# EAGLE design PCB-Neopixel Control (EAGLE 9.5.2)
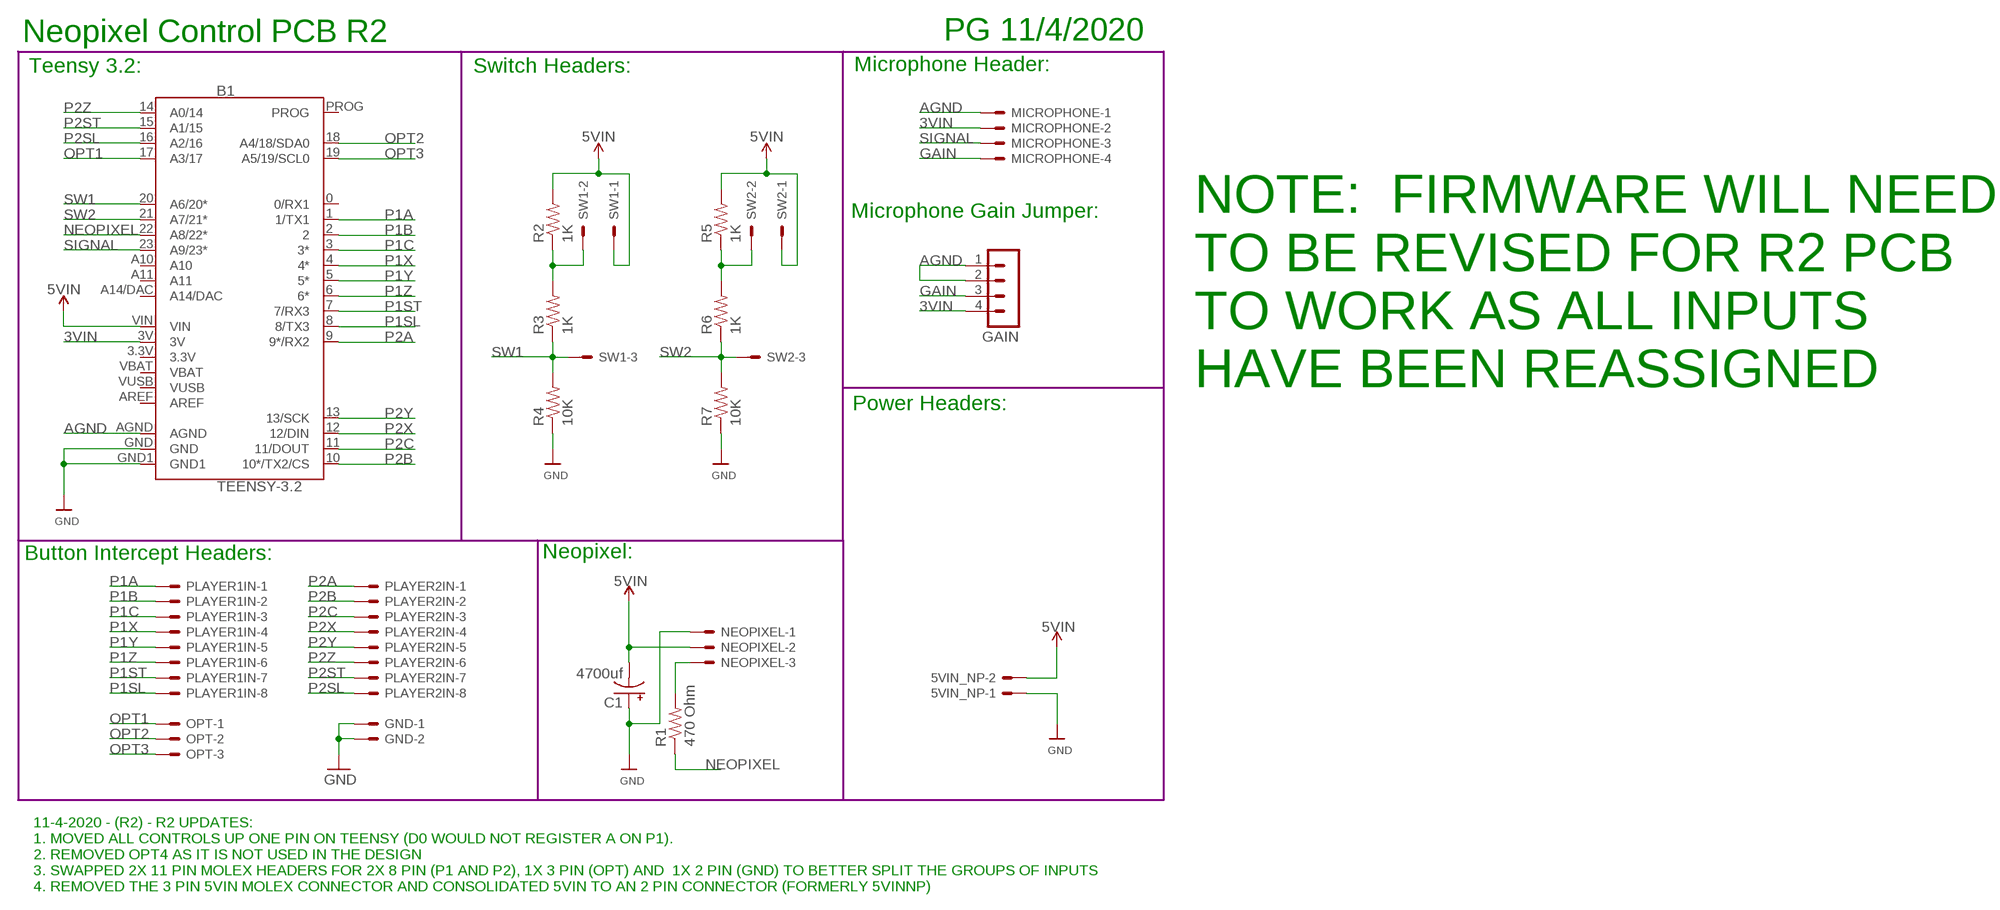
[diagram p0: schematic, sheet 1]

## Parts
5VIN_NP  KK-156-2  [KK-156-2]
B1  TEENSY-3.2  TEENSY-3.1SILK  [TEENSY-3.1]
C1  4700uf  CPOL-USE5-13  [E5-13]
GAIN  MA04-1  [MA04-1]
GND  KK-156-2  [KK-156-2]
MICROPHONE  KK-156-4  [KK-156-4]
NEOPIXEL  KK-156-3  [KK-156-3]
OPT  KK-156-3  [KK-156-3]
PLAYER1IN  KK-156-8  [KK-156-8]
PLAYER2IN  KK-156-8  [KK-156-8]
R1  470 Ohm  R-US_R1206  [R1206]
R2  1K  R-US_R1206  [R1206]
R3  1K  R-US_R1206  [R1206]
R4  10K  R-US_R1206  [R1206]
R5  1K  R-US_R1206  [R1206]
R6  1K  R-US_R1206  [R1206]
R7  10K  R-US_R1206  [R1206]
SW1  KK-156-3  [KK-156-3]
SW2  KK-156-3  [KK-156-3]

## Nets
3VIN: B1.3V GAIN.4 MICROPHONE.2
5VIN: 5VIN_NP.2 B1.VIN C1.- NEOPIXEL.2 R2.2 R5.2 SW1.1 SW2.1 ; supply symbol labelled 5VINNP
AGND: B1.AGND GAIN.1 GAIN.2 MICROPHONE.1
GAIN: GAIN.3 MICROPHONE.4
GND: 5VIN_NP.1 B1.GND B1.GND1 C1.+ GND.1 GND.2 NEOPIXEL.1 R4.1 R7.1
NEOPIXEL: B1.22(A8/22*) R1.1
NP2T: NEOPIXEL.3 R1.2
OPT1: B1.17(A3/17) OPT.1
OPT2: B1.18(A4/18/SDA0) OPT.2
OPT3: B1.19(A5/19/SCL0) OPT.3
P1A: B1.1(1/TX1) PLAYER1IN.1
P1B: B1.2 PLAYER1IN.2
P1C: B1.3(3*) PLAYER1IN.3
P1SL: B1.8(8/TX3) PLAYER1IN.8
P1ST: B1.7(7/RX3) PLAYER1IN.7
P1X: B1.4(4*) PLAYER1IN.4
P1Y: B1.5(5*) PLAYER1IN.5
P1Z: B1.6(6*) PLAYER1IN.6
P2A: B1.9(9*/RX2) PLAYER2IN.1
P2B: B1.10(10*/TX2/CS) PLAYER2IN.2
P2C: B1.11(11/DOUT) PLAYER2IN.3
P2SL: B1.16(A2/16) PLAYER2IN.8
P2ST: B1.15(A1/15) PLAYER2IN.7
P2X: B1.12(12/DIN) PLAYER2IN.4
P2Y: B1.13(13/SCK) PLAYER2IN.5
P2Z: B1.14(A0/14) PLAYER2IN.6
SIGNAL: B1.23(A9/23*) MICROPHONE.3
SW1: B1.20(A6/20*) R3.1 R4.2 SW1.3
SW1A: R2.1 R3.2 SW1.2
SW2: B1.21(A7/21*) R6.1 R7.2 SW2.3
SW2A: R5.1 R6.2 SW2.2
Unconnected: B1.0(0/RX1) B1.A10 B1.A11 B1.A14/DAC B1.AREF B1.PROG

## Notes on the sheet
- Neopixel Control PCB R2 | PG 11/4/2020
- Teensy 3.2: | Switch Headers: | Microphone Header:
- Microphone Gain Jumper:
- NOTE:  FIRMWARE WILL NEED 
  TO BE REVISED FOR R2 PCB 
  TO WORK AS ALL INPUTS 
  HAVE BEEN REASSIGNED
- Power Headers:
- Button Intercept Headers: | Neopixel:
- 11-4-2020 - (R2) - R2 UPDATES:
  1. MOVED ALL CONTROLS UP ONE PIN ON TEENSY (D0 WOULD NOT REGISTER A ON P1).
  2. REMOVED OPT4 AS IT IS NOT USED IN THE DESIGN
  3. SWAPPED 2X 11 PIN MOLEX HEADERS FOR 2X 8 PIN (P1 AND P2), 1X 3 PIN (OPT) AND  1X 2 PIN (GND) TO BETTER SPLIT THE GROUPS OF INPUTS
  4. REMOVED THE 3 PIN 5VIN MOLEX CONNECTOR AND CONSOLIDATED 5VIN TO AN 2 PIN CONNECTOR (FORMERLY 5VINNP)

## Power pins joined to a net without a drawn wire
3.3V: B1.3.3V
VBAT: B1.VBAT
VUSB: B1.VUSB

## Library data of the parts
5VIN_NP GND = con-molex:KK-156-2: KK 156 HEADER Source: http://www.molex.com/pdm_docs/sd/026604100_sd.pdf; MF: MOLEX; OC_FARNELL: unknown; OC_NEWARK: unknown
B1 = SparkFun-Boards:TEENSY-3.1: Teensy 3+ Footprint Mechanical footprint with connectors for Teensy Development Board with ARM Cortex. SparkFun Products: Teensy 3.2 <https://www.sparkfun.com/products/13736> Teensy LC <https://www.sparkfun.com/products/13305>; SF_ID: DEV-12646
C1 = adafruit:CPOL-US: POLARIZED CAPACITOR, American symbol
GAIN = con-lstb:MA04-1: PIN HEADER; OC_FARNELL: unknown; OC_NEWARK: unknown
MICROPHONE = con-molex:KK-156-4: KK 156 HEADER Source: http://www.molex.com/pdm_docs/sd/026604100_sd.pdf; MF: MOLEX; OC_FARNELL: unknown; OC_NEWARK: unknown
NEOPIXEL OPT SW1 SW2 = con-molex:KK-156-3: KK 156 HEADER Source: http://www.molex.com/pdm_docs/sd/026604100_sd.pdf; MF: MOLEX; OC_FARNELL: unknown; OC_NEWARK: unknown
PLAYER1IN PLAYER2IN = con-molex:KK-156-8: KK 156 HEADER Source: http://www.molex.com/pdm_docs/sd/026604100_sd.pdf; MF: MOLEX; OC_FARNELL: unknown; OC_NEWARK: unknown
R1-R7 = adafruit:R-US_: RESISTOR, American symbol

## Board
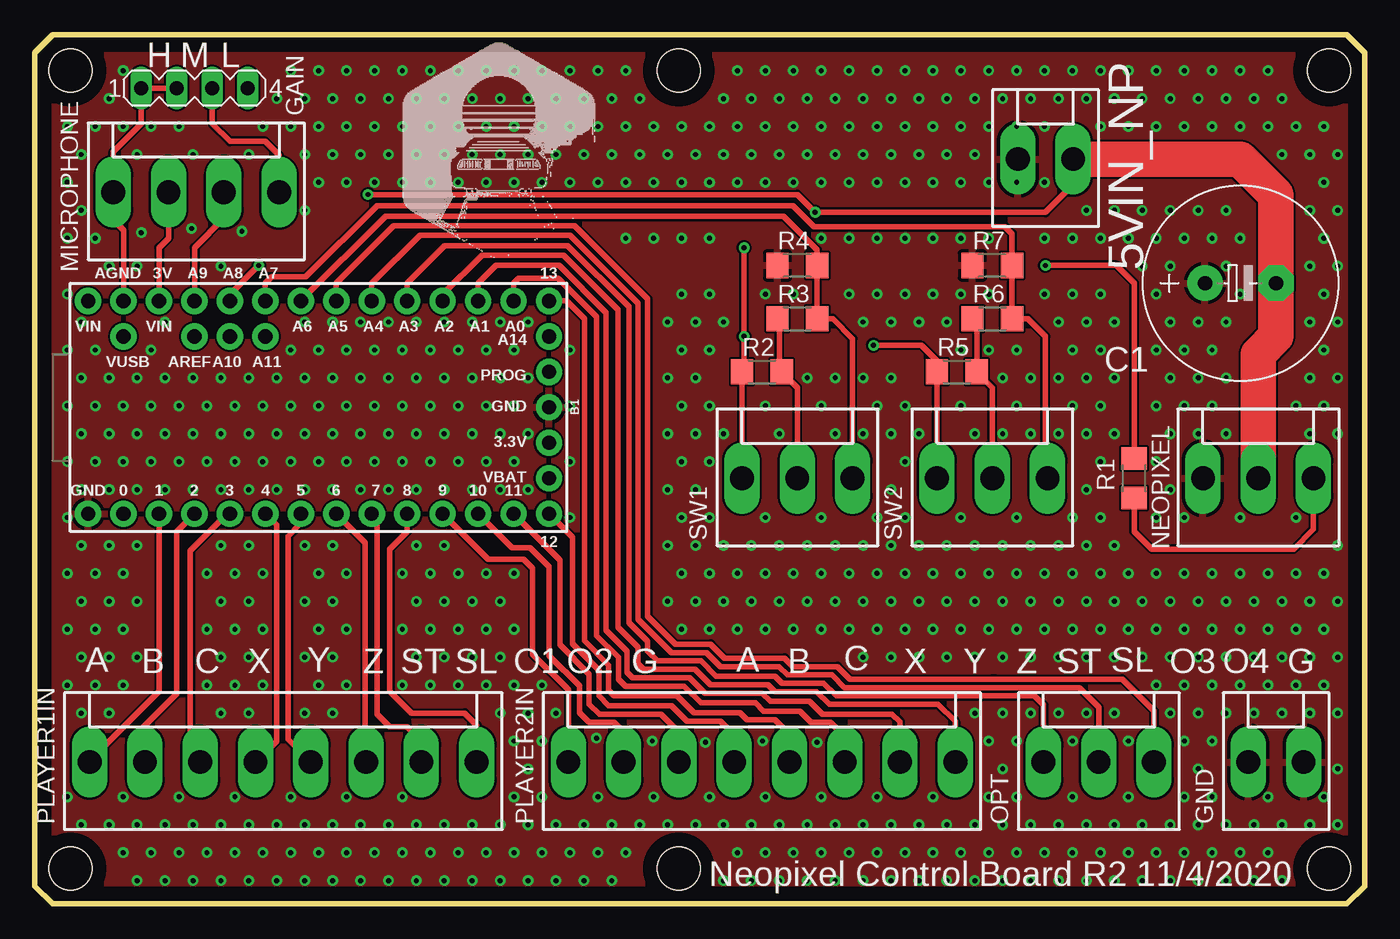
[diagram p1: board, top side]
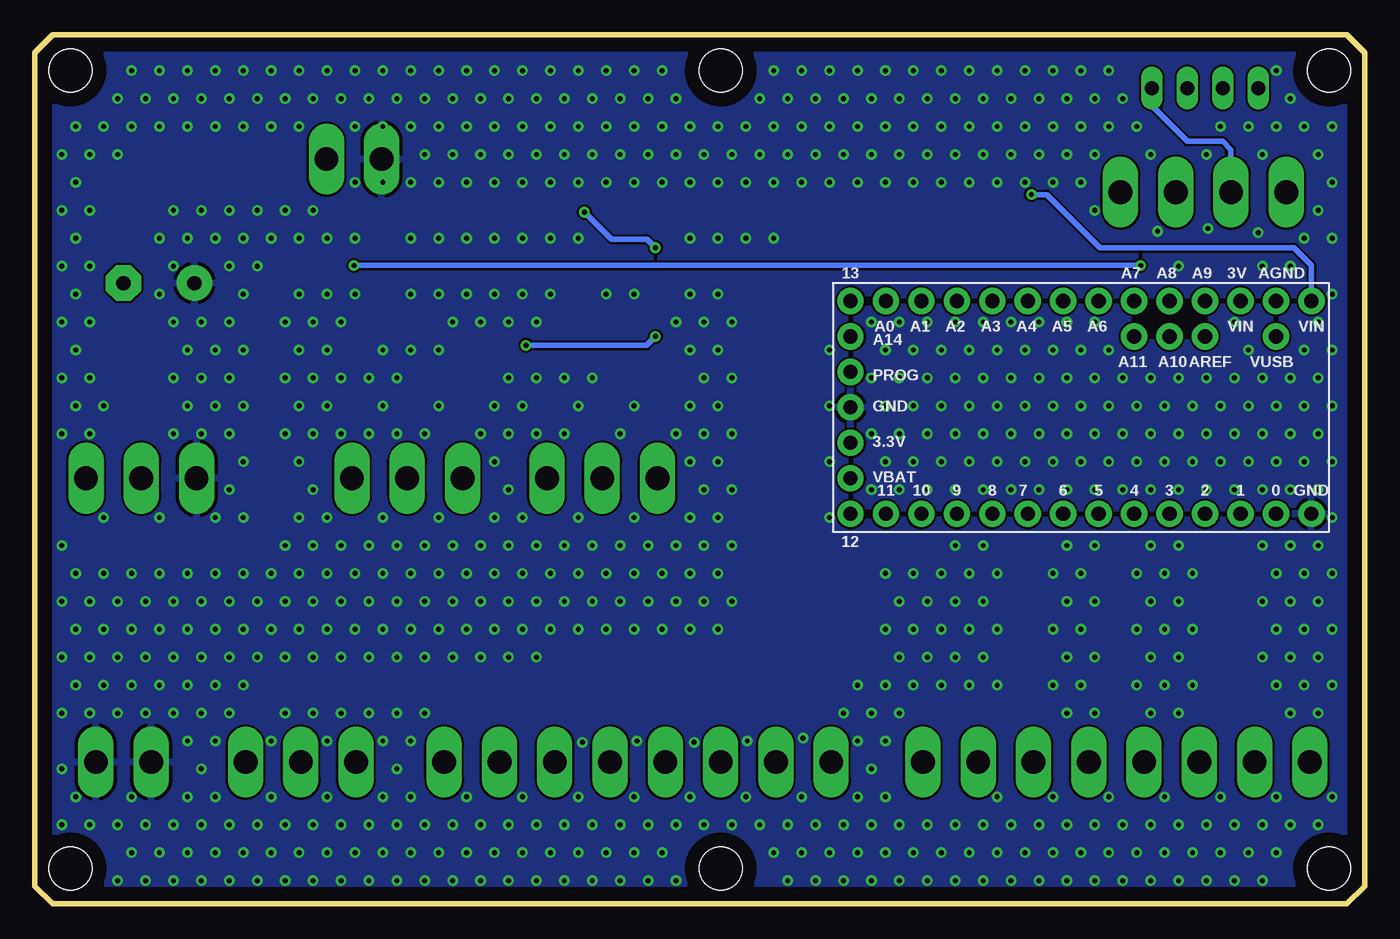
[diagram p2: board, bottom side, seen from below]

Size 95.25 x 62.23 mm. Coordinates in mm from the lower left corner, seen from the top.
Outline: 0,1.27 0,60.96 1.27,62.23 93.98,62.23 95.25,60.96 95.25,1.27 93.98,0 1.27,0 0,1.27
Copper layers (1*16): Top 0.035mm / dielectric 1.5mm / Bottom 0.035mm
Design rules "default": minimum track width 6mil, minimum drill 0.35mm, track to track 6mil, track to pad 6mil, pad to pad 6mil, via to via 6mil, smd to smd 6mil, copper to edge 40mil, drill to drill 6mil, minimum pad ring 10mil, minimum via ring 8mil, stop-mask expansion 4mil, vias tented up to drill 0.5mm, thermal gap 10mil
Holes 3.1 mm at 92.71,59.69 2.54,59.69 2.54,2.54 92.71,2.54 46.12,2.54 46.12,59.69

### Footprints (pad centres in the part's own frame; a part is rotated, then mirrored left to right if it is on the bottom)
KK-156-2 = drill 1.7 pad 2.184 long: 1 -1.98,0; 2 1.98,0
TEENSY-3.1 = drill 1.016 pad 1.88: 0 7.62,-13.97; 1 7.62,-11.43; 2 7.62,-8.89; 3 7.62,-6.35; 3.3V 2.54,16.51; 3V -7.62,-11.43; 4 7.62,-3.81; 5 7.62,-1.27; 6 7.62,1.27; 7 7.62,3.81; 8 7.62,6.35; 9 7.62,8.89; 10 7.62,11.43; 11 7.62,13.97; 12 7.62,16.51; 13 -7.62,16.51; 14 -7.62,13.97; 15 -7.62,11.43; 16 -7.62,8.89; 17 -7.62,6.35; 18 -7.62,3.81; 19 -7.62,1.27; 20 -7.62,-1.27; 21 -7.62,-3.81; 22 -7.62,-6.35; 23 -7.62,-8.89; A10 -5.08,-6.35; A11 -5.08,-3.81; A14/DAC -5.08,16.51; AGND -7.62,-13.97; AREF -5.08,-8.89; GND 0,16.51; GND1 7.62,-16.51; PROG -2.54,16.51; VBAT 5.08,16.51; VIN -7.62,-16.51; VUSB -5.08,-13.97
E5-13 = drill 1.016 pad 2.54: + -2.54,0 | drill 1.016 pad 2.54 octagon: - 2.54,0
MA04-1 = drill 1.016 long: 1 -3.81,0; 2 -1.27,0; 3 1.27,0; 4 3.81,0
KK-156-4 = drill 1.7 pad 2.184 long: 1 -5.94,0; 2 -1.98,0; 3 1.98,0; 4 5.94,0
KK-156-3 = drill 1.7 pad 2.184 long: 1 -3.96,0; 2 0,0; 3 3.96,0
KK-156-8 = drill 1.7 pad 2.184 long: 1 -13.86,0; 2 -9.9,0; 3 -5.94,0; 4 -1.98,0; 5 1.98,0; 6 5.94,0; 7 9.9,0; 8 13.86,0
R1206 = smd 1.6 x 1.803: 1 -1.422,0; 2 1.422,0

### Placement (x,y rotation side)
5VIN_NP  72.39,53.34 0 top
B1  20.32,35.56 270 top
C1  86.36,44.45 0 top
GAIN  11.43,58.42 0 top
GND  88.9,10.16 0 top
MICROPHONE  11.55,50.97 0 top
NEOPIXEL  87.63,30.48 0 top
OPT  76.2,10.16 0 top
PLAYER1IN  17.78,10.16 0 top
PLAYER2IN  52.07,10.16 0 top
R1  78.74,30.48 270 top
R2  52.07,38.1 180 top
R3  54.61,41.91 180 top
R4  54.61,45.72 0 top
R5  66.04,38.1 180 top
R6  68.58,41.91 180 top
R7  68.58,45.72 0 top
SW1  54.61,30.48 0 top
SW2  68.58,30.48 0 top

### Tracks (layer width: path | path; a pad name or v marks a point on that pad's centre or on a via)
3VIN
  Top 0.406: MICROPHONE.2 9.57,47.67 8.89,46.99 B1.3V
  Bottom 0.406: MICROPHONE.2 9.57,54.02 10.16,54.61 12.7,54.61 15.24,57.15 GAIN.4
5VIN  (via drill 0.35)
  Top 0.406: SW1.1 R2.2 | R2.2 | SW2.1 R5.2 64.62,38.89 63.5,40.01 v60.07,40.01 | R2.2 50.8,38.25 v50.8,40.64 v50.8,46.99 | 5VIN_NP.2 74.37,51.51 72.39,49.53 v55.88,49.53 54.61,50.8 v23.86,50.8
  Top 2.54: NEOPIXEL.2 87.63,39.37 88.9,40.64 C1.- 88.9,50.8 86.36,53.34 5VIN_NP.2
  Bottom 0.406: v60.07,40.01 51.44,40.01 v50.8,40.64 | v23.86,50.8 22.76,50.8 18.95,46.99 5.08,46.99 3.81,45.72 B1.VIN | v50.8,46.99 51.41,47.6 53.95,47.6 v55.88,49.53
AGND
  Top 0.406: GAIN.2 GAIN.1 7.62,55.88 5.61,53.87 MICROPHONE.1 5.61,49 6.35,48.26 B1.AGND
GAIN
  Top 0.406: MICROPHONE.4 17.49,53.63 16.51,54.61 13.97,54.61 12.7,55.88 GAIN.3
GND  (via drill 0.35)
  other vias: 3.33,5.67 2.33,7.67 3.33,13.67 2.33,15.67 3.33,17.67 2.33,19.67 3.33,21.67 2.33,23.67 3.33,25.67 2.33,27.67 3.33,29.67 2.33,31.67 3.33,33.67 2.33,35.67 3.33,37.67 2.33,39.67 3.33,41.67 2.33,43.67 2.33,47.67 3.33,49.67 2.33,51.67 3.33,53.67 2.33,55.67 5.33,5.67 5.33,13.67 4.33,15.67 5.33,17.67 4.33,19.67 5.33,21.67 4.33,23.67 5.33,25.67 5.33,29.67 4.33,31.67 5.33,33.67 4.33,35.67 5.33,37.67 4.33,39.67 5.33,45.67 4.33,47.67 4.33,55.67 5.33,57.67 7.33,1.67 6.33,3.67 7.33,5.67 6.33,7.67 6.33,15.67 7.33,17.67 6.33,19.67 7.33,21.67 6.33,23.67 7.33,25.67 7.33,29.67 6.33,31.67 7.33,33.67 6.33,35.67 7.33,37.67 7.33,45.67 7.33,53.67 6.33,55.67 6.33,59.67 9.33,1.67 8.33,3.67 9.33,5.67 9.33,29.67 8.33,31.67 9.33,33.67 8.33,35.67 9.33,37.67 8.33,39.67 9.33,41.67 7.63,48.07 8.33,55.67 11.33,1.67 10.33,3.67 11.33,5.67 10.33,7.67 11.33,29.67 10.33,31.67 11.33,33.67 10.33,35.67 11.33,37.67 11.23,48.37 11.33,53.67 10.33,55.67 13.33,1.67 12.33,3.67 13.33,5.67 13.33,13.67 12.33,15.67 13.33,17.67 12.33,19.67 13.33,21.67 12.33,23.67 13.33,25.67 13.33,29.67 12.33,31.67 13.33,33.67 12.33,35.67 13.33,37.67 13.33,45.67 15.33,1.67 14.33,3.67 15.33,5.67 14.33,7.67 15.33,13.67 14.33,15.67 15.33,17.67 14.33,19.67 15.33,21.67 14.33,23.67 15.33,25.67 15.33,29.67 14.33,31.67 15.33,33.67 14.33,35.67 15.33,37.67 14.83,48.17 15.33,53.67 17.33,1.67 16.33,3.67 17.33,5.67 16.33,15.67 16.33,19.67 16.33,23.67 17.33,29.67 16.33,31.67 17.33,33.67 16.33,35.67 17.33,37.67 16.33,55.67 17.33,57.67 19.33,1.67 18.33,3.67 19.33,5.67 18.33,7.67 19.33,13.67 19.33,17.67 19.33,21.67 19.33,25.67 19.33,29.67 18.33,31.67 19.33,33.67 18.33,35.67 19.33,37.67 18.33,39.67 19.33,41.67 19.33,49.67 19.33,53.67 18.33,55.67 19.33,57.67 18.33,59.67 21.33,1.67 20.33,3.67 21.33,5.67 21.33,13.67 20.33,15.67 21.33,17.67 20.33,19.67 21.33,21.67 20.33,23.67 21.33,25.67 21.33,29.67 20.33,31.67 21.33,33.67 20.33,35.67 21.33,37.67 20.33,39.67 21.33,41.67 20.33,51.67 21.33,53.67 20.33,55.67 21.33,57.67 20.33,59.67 23.33,1.67 22.33,3.67 23.33,5.67 22.33,7.67 22.33,15.67 22.33,19.67 22.33,23.67 23.33,29.67 22.33,31.67 23.33,33.67 22.33,35.67 23.33,37.67 22.33,39.67 23.33,41.67 22.33,51.67 23.33,53.67 22.33,55.67 23.33,57.67 22.33,59.67 25.33,1.67 24.33,3.67 25.33,5.67 25.33,29.67 24.33,31.67 25.33,33.67 24.33,35.67 25.33,37.67 24.33,39.67 25.33,41.67 24.33,51.67 25.33,53.67 24.33,55.67 25.33,57.67 24.33,59.67 27.33,1.67 26.33,3.67 27.33,5.67 26.33,7.67 26.33,15.67 27.33,17.67 26.33,19.67 27.33,21.67 26.33,23.67 27.33,25.67 27.33,29.67 26.33,31.67 27.33,33.67 26.33,35.67 27.33,37.67 26.33,39.67 27.33,41.67 26.33,51.67 27.33,53.67 26.33,55.67 27.33,57.67 26.33,59.67 29.33,1.67 28.33,3.67 29.33,5.67 28.33,15.67 29.33,17.67 28.33,19.67 29.33,21.67 28.33,23.67 29.33,25.67 29.33,29.67 28.33,31.67 29.33,33.67 28.33,35.67 29.33,37.67 28.33,39.67 29.33,41.67 28.33,51.67 29.33,53.67 28.33,55.67 29.33,57.67 28.33,59.67 31.33,1.67 30.33,3.67 31.33,5.67 30.33,15.67 31.33,17.67 30.33,19.67 31.33,21.67 30.33,23.67 31.33,29.67 30.33,31.67 31.33,33.67 30.33,35.67 31.33,37.67 30.33,39.67 31.33,41.67 30.33,51.67 31.33,53.67 30.33,55.67 31.33,57.67 30.33,59.67 33.33,1.67 32.33,3.67 33.33,5.67 33.33,13.67 32.33,15.67 33.33,17.67 32.33,19.67 33.33,21.67 32.33,23.67 33.33,29.67 32.33,31.67 33.33,33.67 32.33,35.67 33.33,37.67 32.33,39.67 33.33,41.67 32.33,51.67 33.33,53.67 32.33,55.67 33.33,57.67 32.33,59.67 35.33,1.67 34.33,3.67 35.33,5.67 34.33,7.67 35.33,9.67 34.33,11.67 35.33,13.67 34.33,15.67 34.33,19.67 34.33,23.67 35.33,29.67 34.33,31.67 35.33,33.67 34.33,35.67 35.33,37.67 34.33,39.67 35.33,41.67 34.33,51.67 35.33,53.67 34.33,55.67 35.33,57.67 34.33,59.67 37.33,1.67 36.33,3.67 37.33,5.67 36.33,7.67 36.33,11.67 37.33,13.67 36.33,15.67 36.33,51.67 37.33,53.67 36.33,55.67 37.33,57.67 36.33,59.67 39.33,1.67 38.33,3.67 39.33,5.67 38.33,27.67 38.33,31.67 38.33,35.67 38.33,39.67 38.33,51.67 39.33,53.67 38.33,55.67 39.33,57.67 38.33,59.67 41.33,1.67 40.33,3.67 41.33,5.67 40.33,7.67 40.23,11.87 40.33,51.67 41.33,53.67 40.33,55.67 41.33,57.67 40.33,59.67 42.33,3.67 43.33,5.67 42.33,47.67 42.33,51.67 43.33,53.67 42.33,55.67 43.33,57.67 42.33,59.67 45.33,5.67 44.33,7.67 44.23,11.67 45.33,21.67 45.33,25.67 45.33,29.67 45.33,33.67 45.33,37.67 45.33,41.67 44.33,47.67 44.33,51.67 45.33,53.67 44.33,55.67 47.33,5.67 46.33,19.67 47.33,21.67 46.33,23.67 47.33,25.67 46.33,27.67 47.33,29.67 46.33,31.67 47.33,33.67 46.33,35.67 47.33,37.67 46.33,39.67 47.33,41.67 46.33,43.67 46.33,47.67 46.33,51.67 47.33,53.67 46.33,55.67 49.33,1.67 49.33,5.67 48.33,7.67 48.03,11.57 48.33,19.67 49.33,21.67 48.33,23.67 49.33,25.67 48.33,27.67 48.33,31.67 49.33,33.67 48.33,35.67 48.33,39.67 49.33,41.67 48.33,43.67 48.33,47.67 48.33,51.67 49.33,53.67 48.33,55.67 49.33,57.67 51.33,1.67 50.33,3.67 51.33,5.67 50.33,19.67 51.33,21.67 50.33,23.67 51.33,25.67 50.33,51.67 51.33,53.67 50.33,55.67 51.33,57.67 50.33,59.67 53.33,1.67 52.33,3.67 53.33,5.67 52.33,7.67 52.13,11.67 52.33,19.67 53.33,21.67 52.33,23.67 53.33,25.67 52.33,27.67 53.33,33.67 52.33,35.67 52.33,43.67 52.33,51.67 53.33,53.67 52.33,55.67 53.33,57.67 52.33,59.67 55.33,1.67 54.33,3.67 55.33,5.67 54.33,19.67 55.33,21.67 54.33,23.67 55.33,25.67 55.33,37.67 54.33,43.67 54.33,51.67 55.33,53.67 54.33,55.67 55.33,57.67 54.33,59.67 57.33,1.67 56.33,3.67 57.33,5.67 56.33,7.67 56.03,11.57 56.33,19.67 57.33,21.67 56.33,23.67 57.33,25.67 56.33,27.67 57.33,33.67 56.33,35.67 57.33,37.67 56.33,47.67 56.33,51.67 57.33,53.67 56.33,55.67 57.33,57.67 56.33,59.67 59.33,1.67 58.33,3.67 59.33,5.67 59.33,17.67 58.33,19.67 59.33,21.67 58.33,23.67 59.33,25.67 59.33,33.67 59.33,37.67 59.33,41.67 58.33,43.67 58.33,47.67 58.33,51.67 59.33,53.67 58.33,55.67 59.33,57.67 58.33,59.67 61.33,1.67 60.33,3.67 61.33,5.67 60.33,7.67 61.33,17.67 60.33,19.67 61.33,21.67 60.33,23.67 61.33,25.67 60.33,27.67 61.33,29.67 61.33,33.67 60.33,35.67 61.33,37.67 61.33,41.67 60.33,43.67 60.33,47.67 60.33,51.67 61.33,53.67 60.33,55.67 61.33,57.67 60.33,59.67 63.33,1.67 62.33,3.67 63.33,5.67 63.33,17.67 62.33,19.67 63.33,21.67 62.33,23.67 63.33,25.67 62.33,27.67 62.33,31.67 63.33,33.67 62.33,35.67 63.33,41.67 62.33,43.67 62.33,47.67 62.33,51.67 63.33,53.67 62.33,55.67 63.33,57.67 62.33,59.67 65.33,1.67 64.33,3.67 65.33,5.67 64.33,7.67 65.33,17.67 64.33,19.67 65.33,21.67 64.33,23.67 65.33,25.67 65.33,41.67 64.33,43.67 64.33,47.67 64.33,51.67 65.33,53.67 64.33,55.67 65.33,57.67 64.33,59.67 67.33,1.67 66.33,3.67 67.33,5.67 67.33,13.67 67.33,17.67 66.33,19.67 67.33,21.67 66.33,23.67 67.33,25.67 66.33,27.67 67.33,33.67 66.33,35.67 66.33,39.67 66.33,43.67 66.33,47.67 66.33,51.67 67.33,53.67 66.33,55.67 67.33,57.67 66.33,59.67 69.33,1.67 68.33,3.67 69.33,5.67 68.33,7.67 69.33,9.67 68.33,11.67 69.33,13.67 69.33,17.67 68.33,19.67 69.33,21.67 68.33,23.67 69.33,25.67 69.33,33.67 69.33,37.67 68.33,39.67 68.33,43.67 68.33,47.67 68.33,51.67 68.33,55.67 69.33,57.67 68.33,59.67 71.33,1.67 70.33,3.67 71.33,5.67 70.33,7.67 70.33,11.67 71.33,13.67 71.33,17.67 70.33,19.67 71.33,21.67 70.33,23.67 71.33,25.67 70.33,27.67 71.33,33.67 70.33,35.67 71.33,37.67 70.33,39.67 70.33,51.67 70.33,55.67 71.33,57.67 70.33,59.67 73.33,1.67 72.33,3.67 73.33,5.67 73.33,13.67 73.33,17.67 72.33,19.67 73.33,21.67 72.33,23.67 73.33,25.67 73.33,33.67 73.33,37.67 73.33,41.67 72.33,43.67 72.33,47.67 72.33,51.67 72.33,55.67 73.33,57.67 72.33,59.67 75.33,1.67 74.33,3.67 75.33,5.67 74.33,7.67 74.33,11.67 75.33,13.67 75.33,17.67 74.33,19.67 75.33,21.67 74.33,23.67 75.33,25.67 74.33,27.67 75.33,29.67 75.33,33.67 74.33,35.67 75.33,37.67 74.33,39.67 75.33,41.67 74.33,43.67 74.33,47.67 75.33,49.67 75.33,57.67 74.33,59.67 77.33,1.67 76.33,3.67 77.33,5.67 77.33,13.67 77.33,17.67 76.33,19.67 77.33,21.67 76.33,23.67 77.33,25.67 76.33,27.67 76.33,31.67 77.33,33.67 76.33,35.67 77.33,37.67 76.33,39.67 77.33,41.67 76.33,43.67 76.33,47.67 77.33,49.67 76.33,55.67 77.33,57.67 76.33,59.67 79.33,1.67 78.33,3.67 79.33,5.67 78.33,7.67 78.33,11.67 79.33,17.67 78.33,19.67 79.33,21.67 78.33,23.67 79.33,45.67 78.33,47.67 79.33,49.67 78.33,55.67 79.33,57.67 78.33,59.67 81.33,1.67 80.33,3.67 81.33,5.67 81.33,13.67 80.33,15.67 81.33,17.67 80.33,19.67 81.33,21.67 80.33,23.67 80.33,27.67 81.33,29.67 80.33,31.67 81.33,33.67 80.33,35.67 81.33,37.67 80.33,39.67 81.33,41.67 80.33,43.67 81.33,45.67 80.33,47.67 81.33,49.67 80.33,55.67 81.33,57.67 80.33,59.67 83.33,1.67 82.33,3.67 83.33,5.67 82.33,7.67 83.33,9.67 82.33,11.67 83.33,13.67 82.33,15.67 83.33,17.67 82.33,19.67 83.33,21.67 82.33,23.67 82.33,27.67 83.33,33.67 82.33,35.67 83.33,37.67 82.33,39.67 83.33,41.67 82.33,47.67 83.33,49.67 82.33,55.67 83.33,57.67 82.33,59.67 85.33,1.67 84.33,3.67 85.33,5.67 84.33,7.67 84.33,11.67 85.33,13.67 84.33,15.67 85.33,17.67 84.33,19.67 85.33,21.67 84.33,23.67 85.33,33.67 84.33,35.67 85.33,37.67 84.33,39.67 85.33,41.67 85.33,45.67 84.33,47.67 85.33,49.67 84.33,55.67 85.33,57.67 84.33,59.67 87.33,1.67 86.33,3.67 87.33,5.67 87.33,13.67 86.33,15.67 87.33,17.67 86.33,19.67 87.33,21.67 86.33,23.67 86.33,27.67 86.33,43.67 86.33,47.67 86.33,55.67 87.33,57.67 86.33,59.67 89.33,1.67 88.33,3.67 89.33,5.67 88.33,7.67 89.33,13.67 88.33,15.67 89.33,17.67 88.33,19.67 89.33,21.67 88.33,23.67 89.33,53.67 88.33,55.67 89.33,57.67 88.33,59.67 91.33,5.67 91.33,13.67 90.33,15.67 91.33,17.67 90.33,19.67 91.33,21.67 90.33,23.67 90.33,27.67 91.33,33.67 90.33,35.67 91.33,37.67 91.33,41.67 91.33,45.67 91.33,49.67 91.33,53.67 90.33,55.67 93.33,5.67 92.33,7.67 93.33,9.67 93.33,13.67 92.33,15.67 93.33,17.67 92.33,19.67 93.33,21.67 92.33,23.67 93.33,25.67 93.33,33.67 92.33,35.67 93.33,37.67 92.33,39.67 93.33,41.67 92.33,43.67 93.33,45.67 92.33,47.67 93.33,49.67 92.33,51.67 93.33,53.67 92.33,55.67
  pour Top: 0,0 0,62.23 93.98,62.23 arc-90 95.25,60.96 95.25,1.27 arc-90 93.98,0
  pour Bottom: 0,0 0,62.23 93.98,62.23 arc-90 95.25,60.96 95.25,1.27 arc-90 93.98,0
NEOPIXEL  (via drill 0.35)
  Top 0.406: v16.04,45.72 13.97,43.65 B1.22 | v72.39,45.72 77.47,45.72 78.74,44.45 R1.1
  Bottom 0.406: v72.39,45.72 v16.04,45.72
NP2T
  Top 0.406: NEOPIXEL.3 91.59,26.82 90.17,25.4 80.01,25.4 78.74,26.67 R1.2
OPT1
  Top 0.406: B1.17 26.67,44.45 29.35,47.13 38.17,47.13 42.55,42.75 42.55,20.15 43.9,18.8 43.9,18.1 44.6,17.4 47.7,17.4 48.8,16.3 53,16.3 53.5,15.8 56.5,15.8 57.4,14.9 68.58,14.9 68.8,14.9 71.6,14.9 72.24,14.26 OPT.1
OPT2
  Top 0.406: B1.18 24.13,44.45 27.58,47.9 38.34,47.9 43.22,43.02 43.22,20.38 45.6,18 48.1,18 49.1,17 53.3,17 53.9,16.4 57.1,16.4 58,15.5 67.31,15.5 67.7,15.5 74.8,15.5 76.2,14.1 OPT.2
OPT3
  Top 0.406: B1.19 21.59,44.45 25.71,48.57 38.64,48.57 43.89,43.32 43.89,20.61 45.9,18.6 48.4,18.6 49.4,17.6 53.7,17.6 54.3,17 57.5,17 58.4,16.1 68.58,16.1 68.8,16.1 77.88,16.1 80.16,13.82 OPT.3
P1A
  Top 0.406: B1.1 8.89,15.24 3.92,10.27 PLAYER1IN.1
P1B
  Top 0.406: PLAYER1IN.2 7.62,10.42 7.62,12.5 10.16,15.04 10.16,26.67 B1.2
P1C
  Top 0.406: B1.3 13.77,27.94 11.13,25.3 11.13,10.87 PLAYER1IN.3
P1SL
  Top 0.406: B1.8 26.67,26.67 25.4,25.4 25.4,15.24 26.97,13.67 30.78,13.67 31.64,12.81 PLAYER1IN.8
P1ST
  Top 0.406: B1.7 24.53,27.54 24.53,13.57 25.4,12.7 26.67,12.7 27.68,11.69 PLAYER1IN.7
P1X
  Top 0.406: B1.4 17.3,27.15 17.3,11.66 PLAYER1IN.4
P1Y
  Top 0.406: B1.5 19.05,27.25 18.12,26.32 18.12,11.79 PLAYER1IN.5
P1Z
  Top 0.406: B1.6 23.66,25.87 23.66,10.22 PLAYER1IN.6
P2A
  Top 0.406: PLAYER2IN.1 38.21,15.33 35.66,17.88 35.66,24.04 35,24.7 32.45,24.7 B1.9
P2B
  Top 0.406: B1.10 34.19,25.5 35.46,25.5 36.83,24.13 36.83,17.78 39,15.61 39,13.7 39.7,13 41.5,13 42.2,12.3 42.2,10.19 PLAYER2IN.2
P2C
  Top 0.406: B1.11 37.6,24.63 37.6,18.55 39.71,16.44 39.71,14.31 40.45,13.57 44.85,13.57 46.13,12.29 PLAYER2IN.3
P2SL
  Top 0.406: B1.16 29.21,43.65 32.02,46.46 37.87,46.46 41.78,42.55 41.78,19.82 43.2,18.4 43.2,17.2 43.6,16.8 47.3,16.8 48.4,15.7 52.5,15.7 53,15.2 56,15.2 56.9,14.3 64.7,14.3 65.93,13.07 PLAYER2IN.8
P2ST
  Top 0.406: B1.15 31.75,44.45 33.02,45.72 37.54,45.72 40.91,42.35 40.91,20.32 40.91,20.05 40.91,19.59 42.4,18.1 42.4,16.6 42.8,16.2 46.9,16.2 48,15.1 52.1,15.1 52.7,14.5 55.5,14.5 56.4,13.6 61.4,13.6 61.97,13.03 PLAYER2IN.7
P2X
  Top 0.406: B1.12 38.5,26.27 38.5,18.65 40.4,16.75 40.4,14.9 41.1,14.2 45.6,14.2 46.7,13.1 49.1,13.1 50.09,12.11 PLAYER2IN.4
P2Y
  Top 0.406: B1.13 38.1,43.18 39.37,41.91 39.37,18.83 41.1,17.1 41.1,15.3 41.5,14.9 46,14.9 47.2,13.7 50.5,13.7 51,13.2 53,13.2 54.05,12.15 PLAYER2IN.5
P2Z
  Top 0.406: B1.14 34.29,44.45 34.66,44.82 37.46,44.82 40.24,42.04 40.24,19.22 41.8,17.66 41.8,16.51 41.8,16.1 42.3,15.6 46.5,15.6 47.7,14.4 51.6,14.4 52.2,13.8 54.8,13.8 55.6,13 57,13 58.01,11.99 PLAYER2IN.6
SIGNAL
  Top 0.406: MICROPHONE.3 13.53,49.09 11.43,46.99 B1.23
SW1
  Top 0.406: B1.20 25.11,49.24 45.72,49.24 46.01,49.24 53.63,49.24 56.03,46.84 R4.2 R3.1 57.15,41.91 58.57,40.49 SW1.3
SW1A
  Top 0.406: R3.2 53.34,41.76 53.34,38.25 R2.1 54.61,36.98 SW1.2
SW2
  Top 0.406: SW2.3 72.39,30.63 72.39,40.64 71.12,41.91 R6.1 R7.2 70,48 69.5,48.5 55.8,48.5 54.3,50 46.04,50 45.72,50 24.5,50 19.4,44.9 16.96,44.9 16.51,44.45 B1.21
SW2A
  Top 0.406: SW2.2 68.58,36.98 R5.1 67.46,41.61 R6.2

### Text on the board
tPlace: H | M | L | A | B | C | X | Y | O1 | O2 | A | B | C | X | SL | O3 | O4 | Z | ST | SL | G | Y | Z | ST | G | Neopixel Control Board R2 11/4/2020
Reference: 11-4-2020 - (R2) - R2 UPDATES: / 1. MOVED ALL CONTROLS UP ONE PIN ON TEENSY / (D0 WOULD NOT REGISTER A ON P1). / 2. REMOVED OPT4 AS IT IS NOT USED IN THE DESIGN / 3. SWAPPED 2X 11 PIN MOLEX HEADERS FOR 2X 8 PIN (P1 AND P2), / 1X 3 PIN (OPT) AND 1X 2 PIN (GND) TO BETTER SPLIT THE GROUPS OF INPUTS / 4. REMOVED THE 3 PIN 5VIN MOLEX CONNECTOR AND CONSOLIDATED 5VIN TO / AN 2 PIN CONNECTOR (FORMERLY 5VINNP) / 5. ALL INPUT TRACES RERUN, STICHING RERUN TO MATCH NEW TRACES